# EAGLE design RQ2_supply (EAGLE 7.7.0)
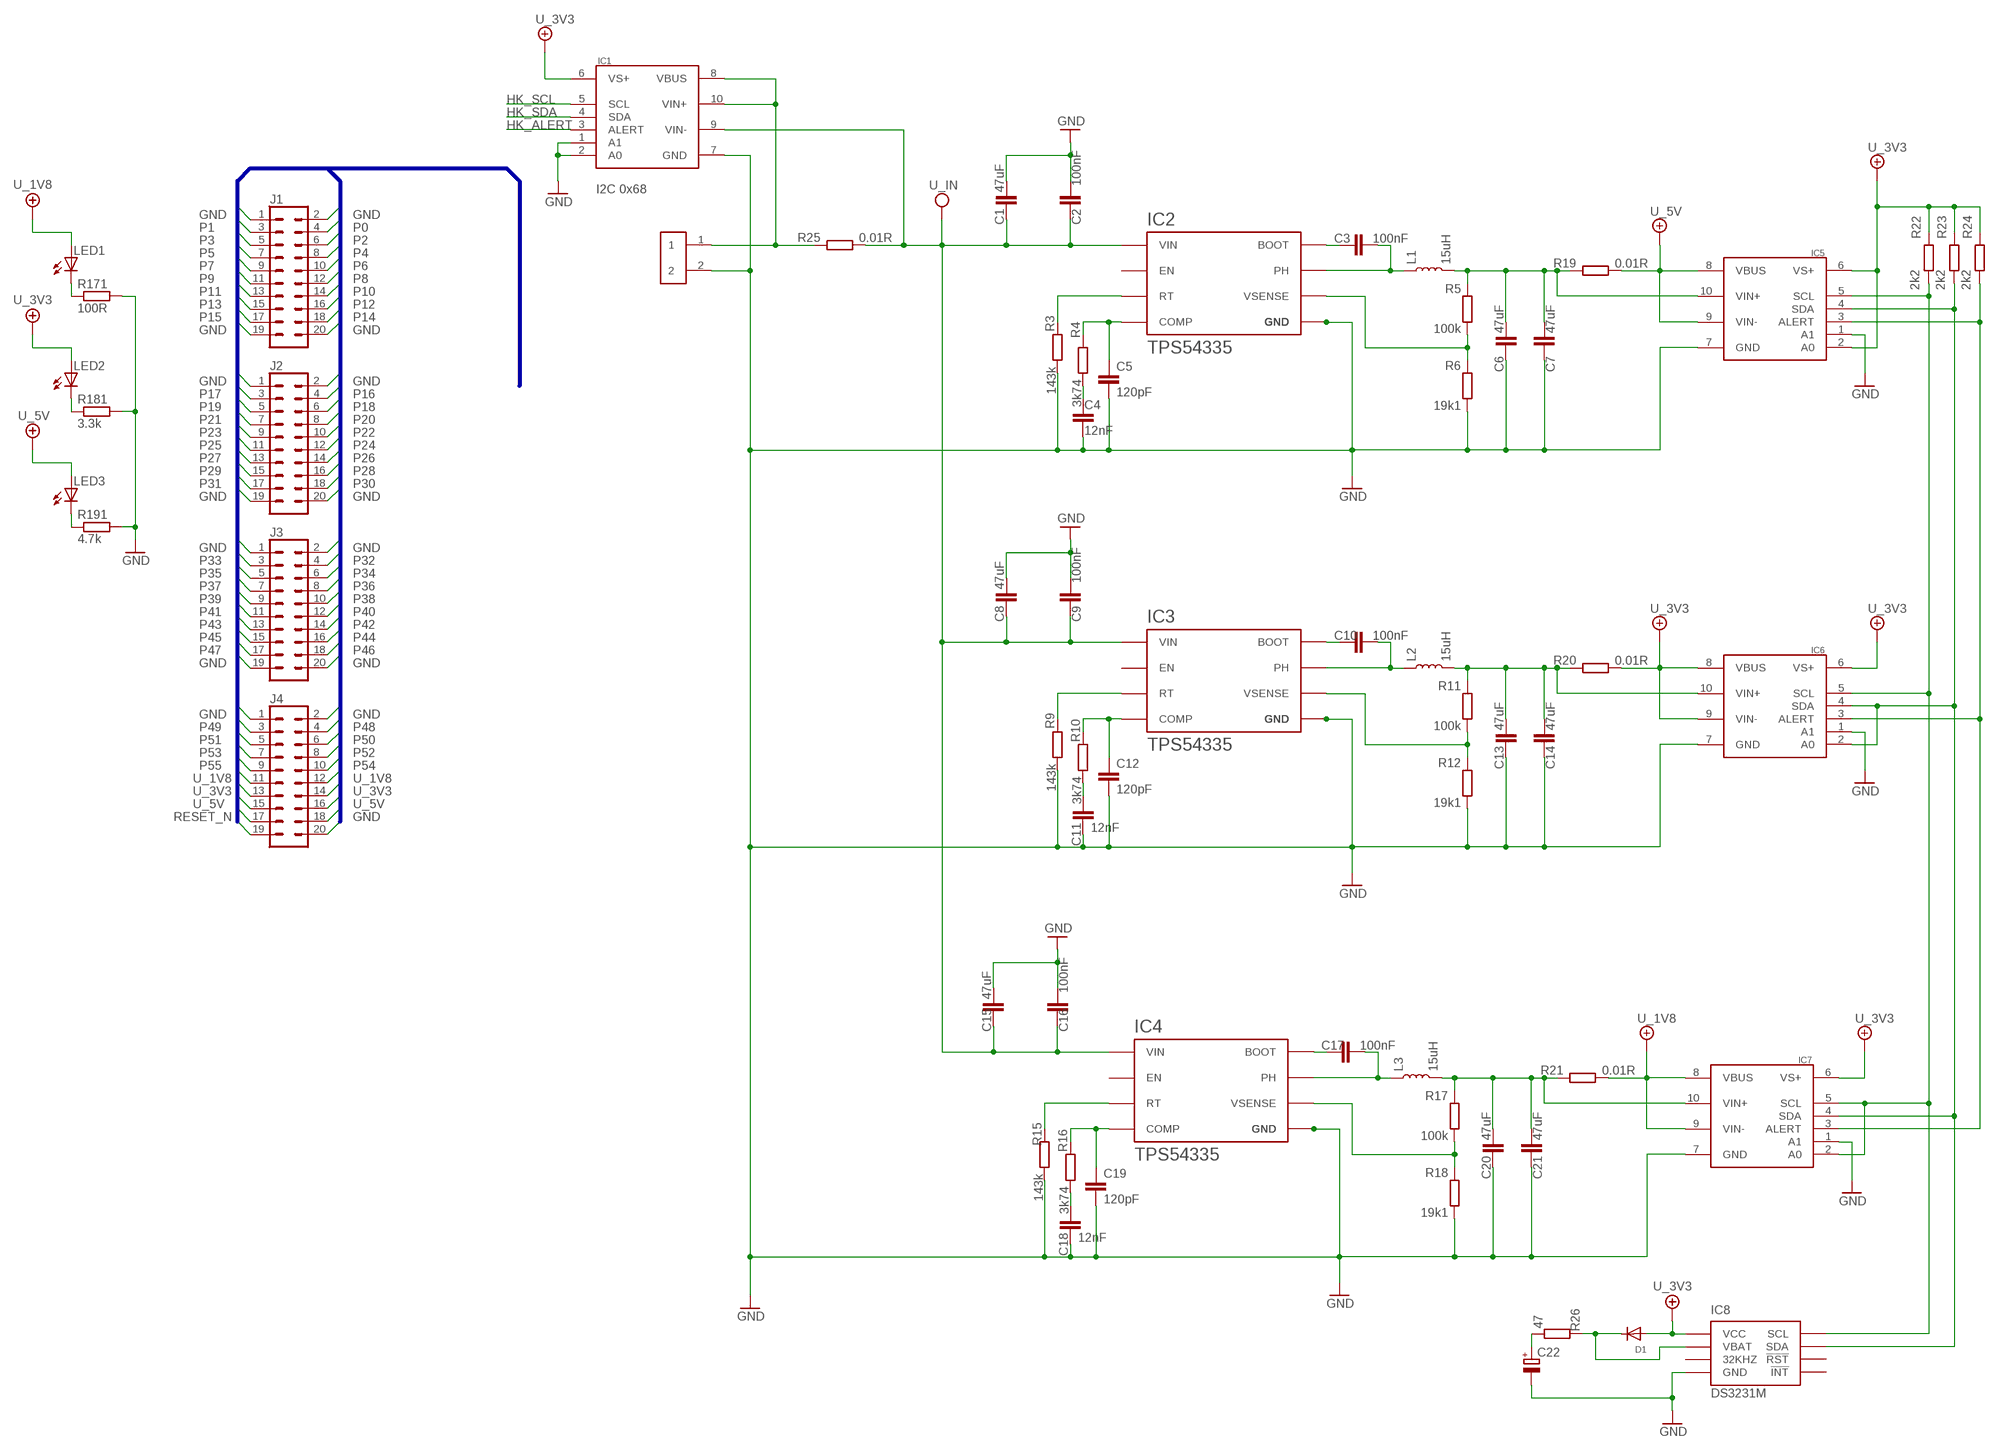
[diagram p0: schematic, sheet 1]

## Parts
C1  47uF  4.7UF-1206-16V-(+80/-20%)  [1206]
C2  100nF  0.1UF-0603-25V-5%  [0603]
C3  100nF  0.1UF-0402-16V-10%  [0402]
C4  12nF  C-EUC0402  [C0402]
C5  120pF  C-EUC0402  [C0402]
C6  47uF  47UF-1206-10V-20%  [1206]
C7  47uF  47UF-1206-10V-20%  [1206]
C8  47uF  4.7UF-1206-16V-(+80/-20%)  [1206]
C9  100nF  0.1UF-0603-25V-5%  [0603]
C10  100nF  0.1UF-0402-16V-10%  [0402]
C11  12nF  C-EUC0402  [C0402]
C12  120pF  C-EUC0402  [C0402]
C13  47uF  47UF-1206-10V-20%  [1206]
C14  47uF  47UF-1206-10V-20%  [1206]
C15  47uF  4.7UF-1206-16V-(+80/-20%)  [1206]
C16  100nF  0.1UF-0603-25V-5%  [0603]
C17  100nF  0.1UF-0402-16V-10%  [0402]
C18  12nF  C-EUC0402  [C0402]
C19  120pF  C-EUC0402  [C0402]
C20  47uF  47UF-1206-10V-20%  [1206]
C21  47uF  47UF-1206-10V-20%  [1206]
C22  CPOL-EUDHL_21.5  [DHL_21.5]
D1  DIODESOD-123  [SOD-123]
IC1  INA226  [VSSOP-10]
IC2  TPS54335ADRCR  [VSON-10]
IC3  TPS54335ADRCR  [VSON-10]
IC4  TPS54335ADRCR  [VSON-10]
IC5  INA226  [VSSOP-10]
IC6  INA226  [VSSOP-10]
IC7  INA226  [VSSOP-10]
IC8  DS3231M  [SO-8]
J1  CONN_10X2  [2X10]
J2  CONN_10X2  [2X10]
J3  CONN_10X2  [2X10]
J4  CONN_10X2  [2X10]
L1  15uH  INDUCTOR-YSPIA0850-15UH  [YSPIA0850]
L2  15uH  INDUCTOR-YSPIA0850-15UH  [YSPIA0850]
L3  15uH  INDUCTOR-YSPIA0850-15UH  [YSPIA0850]
LED1  LEDSML0805  [SML0805]
LED2  LEDSML0805  [SML0805]
LED3  LEDSML0805  [SML0805]
R3  143k  R-EU_R0402  [R0402]
R4  3k74  R-EU_R0402  [R0402]
R5  100k  R-EU_R0402  [R0402]
R6  19k1  R-EU_R0402  [R0402]
R9  143k  R-EU_R0402  [R0402]
R10  3k74  R-EU_R0402  [R0402]
R11  100k  R-EU_R0402  [R0402]
R12  19k1  R-EU_R0402  [R0402]
R15  143k  R-EU_R0402  [R0402]
R16  3k74  R-EU_R0402  [R0402]
R17  100k  R-EU_R0402  [R0402]
R18  19k1  R-EU_R0402  [R0402]
R19  0.01R  R-EU_R1206  [R1206]
R20  0.01R  R-EU_R1206  [R1206]
R21  0.01R  R-EU_R1206  [R1206]
R22  2k2  R-EU_R0402  [R0402]
R23  2k2  R-EU_R0402  [R0402]
R24  2k2  R-EU_R0402  [R0402]
R25  0.01R  R-EU_R1206  [R1206]
R26  47  R-EU_R0603  [R0603]
R171  100R  R-EU_R0805  [R0805]
R181  3.3k  R-EU_R0805  [R0805]
R191  4.7k  R-EU_R0805  [R0805]
U$1  XT_CONN  [XT30_PCB]

## Nets
DCDC_BOOT: C3.2 IC2.9(BOOT)
DCDC_BOOT1: C10.2 IC3.9(BOOT)
DCDC_BOOT2: C17.2 IC4.9(BOOT)
DCDC_COMP: C5.1 IC2.7(COMP) R4.1
DCDC_COMP1: C12.1 IC3.7(COMP) R10.1
DCDC_COMP2: C19.1 IC4.7(COMP) R16.1
DCDC_PH: C3.1 IC2.2(PH) L1.1
DCDC_PH1: C10.1 IC3.2(PH) L2.1
DCDC_PH2: C17.1 IC4.2(PH) L3.1
DCDC_RT: IC2.10(RT) R3.1
DCDC_RT1: IC3.10(RT) R9.1
DCDC_RT2: IC4.10(RT) R15.1
GND: C1.2 C2.1 C4.2 C5.2 C6.1 C7.1 C8.2 C9.1 C11.2 C12.2 C13.1 C14.1 C15.2 C16.1 C18.2 C19.2 C20.1 C21.1 C22.- IC1.1(A1) IC1.2(A0) IC1.7(GND) IC2.11(GND) IC3.11(GND) IC4.11(GND) IC5.1(A1) IC5.7(GND) IC6.1(A1) IC6.7(GND) IC7.1(A1) IC7.7(GND) IC8.5(GND) J1.1 J1.2 J1.19 J1.20 J2.1 J2.2 J2.19 J2.20 J3.1 J3.2 J3.19 J3.20 J4.1 J4.2 J4.18 R3.2 R6.1 R9.2 R12.1 R15.2 R18.1 R171.2 R181.2 R191.2 U$1.2
HK_ALERT: IC1.3(ALERT) IC5.3(ALERT) IC6.3(ALERT) IC7.3(ALERT) R24.1
HK_SCL: IC1.5(SCL) IC5.5(SCL) IC6.5(SCL) IC7.2(A0) IC7.5(SCL) IC8.8(SCL) R22.1
HK_SDA: IC1.4(SDA) IC5.4(SDA) IC6.2(A0) IC6.4(SDA) IC7.4(SDA) IC8.7(SDA) R23.1
N$1: C4.1 R4.2
N$2: LED1.C R171.1
N$3: LED2.C R181.1
N$4: LED3.C R191.1
N$5: C11.1 R10.2
N$7: C18.1 R16.2
P0: J1.4
P1: J1.3
P2: J1.6
P3: J1.5
P4: J1.8
P5: J1.7
P6: J1.10
P7: J1.9
P8: J1.12
P9: J1.11
P10: J1.14
P11: J1.13
P12: J1.16
P13: J1.15
P14: J1.18
P15: J1.17
P16: J2.4
P17: J2.3
P18: J2.6
P19: J2.5
P20: J2.8
P21: J2.7
P22: J2.10
P23: J2.9
P24: J2.12
P25: J2.11
P26: J2.14
P27: J2.13
P28: J2.16
P29: J2.15
P30: J2.18
P31: J2.17
P32: J3.4
P33: J3.3
P34: J3.6
P35: J3.5
P36: J3.8
P37: J3.7
P38: J3.10
P39: J3.9
P40: J3.12
P41: J3.11
P42: J3.14
P43: J3.13
P44: J3.16
P45: J3.15
P46: J3.18
P47: J3.17
P48: J4.4
P49: J4.3
P50: J4.6
P51: J4.5
P52: J4.8
P53: J4.7
P54: J4.10
P55: J4.9
RESET_N: J4.17
RXD: J4.20
TXD: J4.19
U0_1V8: C20.2 C21.2 IC7.10(VIN+) L3.2 R17.2 R21.2
U0_3V3: C13.2 C14.2 IC6.10(VIN+) L2.2 R11.2 R20.2
U0_5V: C6.2 C7.2 IC5.10(VIN+) L1.2 R5.2 R19.2
U0_IN: IC1.8(VBUS) IC1.10(VIN+) R25.2 U$1.1
U_1V8: IC7.8(VBUS) IC7.9(VIN-) J4.11 J4.12 LED1.A R21.1
U_3V3: D1.A IC5.2(A0) IC6.6(VS+) IC6.8(VBUS) IC6.9(VIN-) IC7.6(VS+) IC8.2(VCC) J4.13 J4.14 LED2.A R20.1 R22.2 R23.2 R24.2
U_5V: IC5.8(VBUS) IC5.9(VIN-) J4.15 J4.16 LED3.A R19.1
U_IN: C1.1 C2.2 C8.1 C9.2 C15.1 C16.2 IC1.9(VIN-) IC2.1(VIN) IC3.1(VIN) IC4.1(VIN) R25.1
VBAT1: D1.C IC8.6(VBAT) R26.1
VCAP: C22.+ R26.2
VSENSE_1V8: IC4.6(VSENSE) R17.1 R18.2
VSENSE_3V3: IC3.6(VSENSE) R11.1 R12.2
VSENSE_5V: IC2.6(VSENSE) R5.1 R6.2
Unconnected: IC1.6(VS+) IC2.8(EN) IC3.8(EN) IC4.8(EN) IC5.6(VS+) IC8.1(32KHZ) IC8.3(!INT) IC8.4(!RST)

## Buses
P[0..55],RXD,TXD,RESET_N,XIN,XOUT,U_1V8,U_3V3,U_5V,U_IN,GND

## Notes on the sheet
- I2C 0x68

## Power pins joined to a net without a drawn wire
GND: IC2.3(GND) IC2.4(GND) IC2.5(GND) IC3.3(GND) IC3.4(GND) IC3.5(GND) IC4.3(GND) IC4.4(GND) IC4.5(GND)

## Library data of the parts
C1 C8 C15 = SparkFun-Capacitors:4.7UF: 4.7µF ceramic capacitors A capacitor is a passive two-terminal electrical component used to store electrical energy temporarily in an electric field.; LCSC_PART: C132148; PROD_ID: CAP-10300; VALUE: 4.7uF
C2 C9 C16 = SparkFun-Capacitors:0.1UF: 100nF ceramic capacitors A capacitor is a passive two-terminal electrical component used to store electrical energy temporarily in an electric field.; LCSC_PART: C338036; PROD_ID: CAP-08604
C3 C10 C17 = SparkFun-Capacitors:0.1UF: 100nF ceramic capacitors A capacitor is a passive two-terminal electrical component used to store electrical energy temporarily in an electric field.; LCSC_PART: C338032; PROD_ID: CAP-12416
C4 C5 C11 C12 C18 C19 = rcl_updated:C-EU: CAPACITOR, European symbol
C6 C7 C13 C14 C20 C21 = SparkFun-Capacitors:47UF; LCSC_PART: C94034
C22 = rcl_updated:CPOL-EU: POLARIZED CAPACITOR, European symbol
D1 = adafruit:DIODE: Diode SMADIODE - SMA Surface Mount Package 20V 1A Schottky Diode Digikey: 641-1014-6-ND DO-1N4148 - Through Hole Small Current Diode SOD-123 20V 1 A (.5mV Vf) Schottky Diode - Digikey: MBRX120TPMSCT-ND SOD-323 10V 570mA (.38mV Vf, 3ns) Schottky Diode - Digikey: ZLLS410CT-ND SOD-523 30V 30mA Schottky Diode (RB751S-40TE61) - Digikey: RB751S-40TE61CT-ND SOT23-R/W - SOT23 Package (R = Solder Paste/Reflow Ovens, W = Hand-Soldering) BAT54Film 40V 300mA - Digikey: 497-7162-1-ND
IC1 IC5-IC7 = FaBo-Sensor:INA226; LCSC_PART: C49851
IC2-IC4 = texas_2:TPS54335ADRCR; LCSC_PART: C473400
IC8 = DS3231:DS3231M
J1-J4 = SparkFun-Connectors:CONN_10X2: Multi connection point. Often used as Generic Header-pin footprint for 0.1 inch spaced/style header connections On any of the 0.1 inch spaced packages, you can populate with these: Break Away Headers - Straight <https://www.sparkfun.com/products/116> (PRT-00116) Break Away Male Headers - Right Angle <https://www.sparkfun.com/products/553> (PRT-00553) Female Headers <https://www.sparkfun.com/products/115> (PRT-00115) Break Away Headers - Machine Pin <https://www.sparkfun.com/products/117> (PRT-00117) Break Away Female Headers - Swiss Machine Pin <https://www.sparkfun.com/products/743> (PRT-00743) Special note about the "SPECIAL" package: This was SPECIALLY designed to be used with our Graphic LCD Backpack. Be sure you want to use this! It is not only staggered on each line of header holes, but IT IS ALSO offset of the center point of the top and bottom lines by 5 mil. This causes the headers to lock into place on the "standard" footprint on the LCD screen. The extra squares on the tdocu layer are there simply to reference other pins (if you were to actually populate a longer header than ten long - this is what we do with the backpacks).
L1-L3 = SparkFun-Coils:INDUCTOR: Inductors Resist changes in electrical current. Basically a coil of wire. SparkFun Products: SparkFun Load Cell Amplifier - HX711 <https://www.sparkfun.com/products/13879> IOIO-OTG - V2.2 <https://www.sparkfun.com/products/13613>; LCSC_PART: C2839929
LED1-LED3 = led:LED: LED OSRAM: - CHIPLED LG R971, LG N971, LY N971, LG Q971, LY Q971, LO R971, LY R971 LH N974, LH R974 LS Q976, LO Q976, LY Q976 LO Q996 - Hyper CHIPLED LW Q18S LB Q993, LB Q99A, LB R99A - SideLED LS A670, LO A670, LY A670, LG A670, LP A670 LB A673, LV A673, LT A673, LW A673 LH A674 LY A675 LS A676, LA A676, LO A676, LY A676, LW A676 LS A679, LY A679, LG A679 - Hyper Micro SIDELED® LS Y876, LA Y876, LO Y876, LY Y876 LT Y87S - SmartLED LW L88C, LW L88S LB L89C, LB L89S, LG L890 LS L89K, LO L89K, LY L89K LS L896, LA L896, LO L896, LY L896 - TOPLED LS T670, LO T670, LY T670, LG T670, LP T670 LSG T670, LSP T670, LSY T670, LOP T670, LYG T670 LG T671, LOG T671, LSG T671 LB T673, LV T673, LT T673, LW T673 LH T674 LS T676, LA T676, LO T676, LY T676, LB T676, LH T676, LSB T676, LW T676 LB T67C, LV T67C, LT T67C, LS T67K, LO T67K, LY T67K, LW E67C LS E67B, LA E67B, LO E67B, LY E67B, LB E67C, LV E67C, LT E67C LW T67C LS T679, LY T679, LG T679 LS T770, LO T770, LY T770, LG T770, LP T770 LB T773, LV T773, LT T773, LW T773 LH T774 LS E675, LA E675, LY E675, LS T675 LS T776, LA T776, LO T776, LY T776, LB T776 LHGB T686 LT T68C, LB T68C - Hyper Mini TOPLED® LB M676 - Mini TOPLED Santana® LG M470 LS M47K, LO M47K, LY M47K Source: http://www.osram.convergy.de LUXEON: - LUMILED® LXK2-PW12-R00, LXK2-PW12-S00, LXK2-PW14-U00, LXK2-PW14-V00 LXK2-PM12-R00, LXK2-PM12-S00, LXK2-PM14-U00 LXK2-PE12-Q00, LXK2-PE12-R00, LXK2-PE12-S00, LXK2-PE14-T00, LXK2-PE14-U00 LXK2-PB12-K00, LXK2-PB12-L00, LXK2-PB12-M00, LXK2-PB14-N00, LXK2-PB14-P00, LXK2-PB14-Q00 LXK2-PR12-L00, LXK2-PR12-M00, LXK2-PR14-Q00, LXK2-PR14-R00 LXK2-PD12-Q00, LXK2-PD12-R00, LXK2-PD12-S00 LXK2-PH12-R00, LXK2-PH12-S00 LXK2-PL12-P00, LXK2-PL12-Q00, LXK2-PL12-R00 Source: www.luxeon.com KINGBRIGHT: KA-3528ASYC Source: www.kingbright.com
R3-R6 R9-R12 R15-R25 = rcl_updated:R-EU_: RESISTOR, European symbol
R26 R171 R181 R191 = rcl:R-EU_: RESISTOR, European symbol
U$1 = SparkFun-Connectors:XT_CONN

## Board
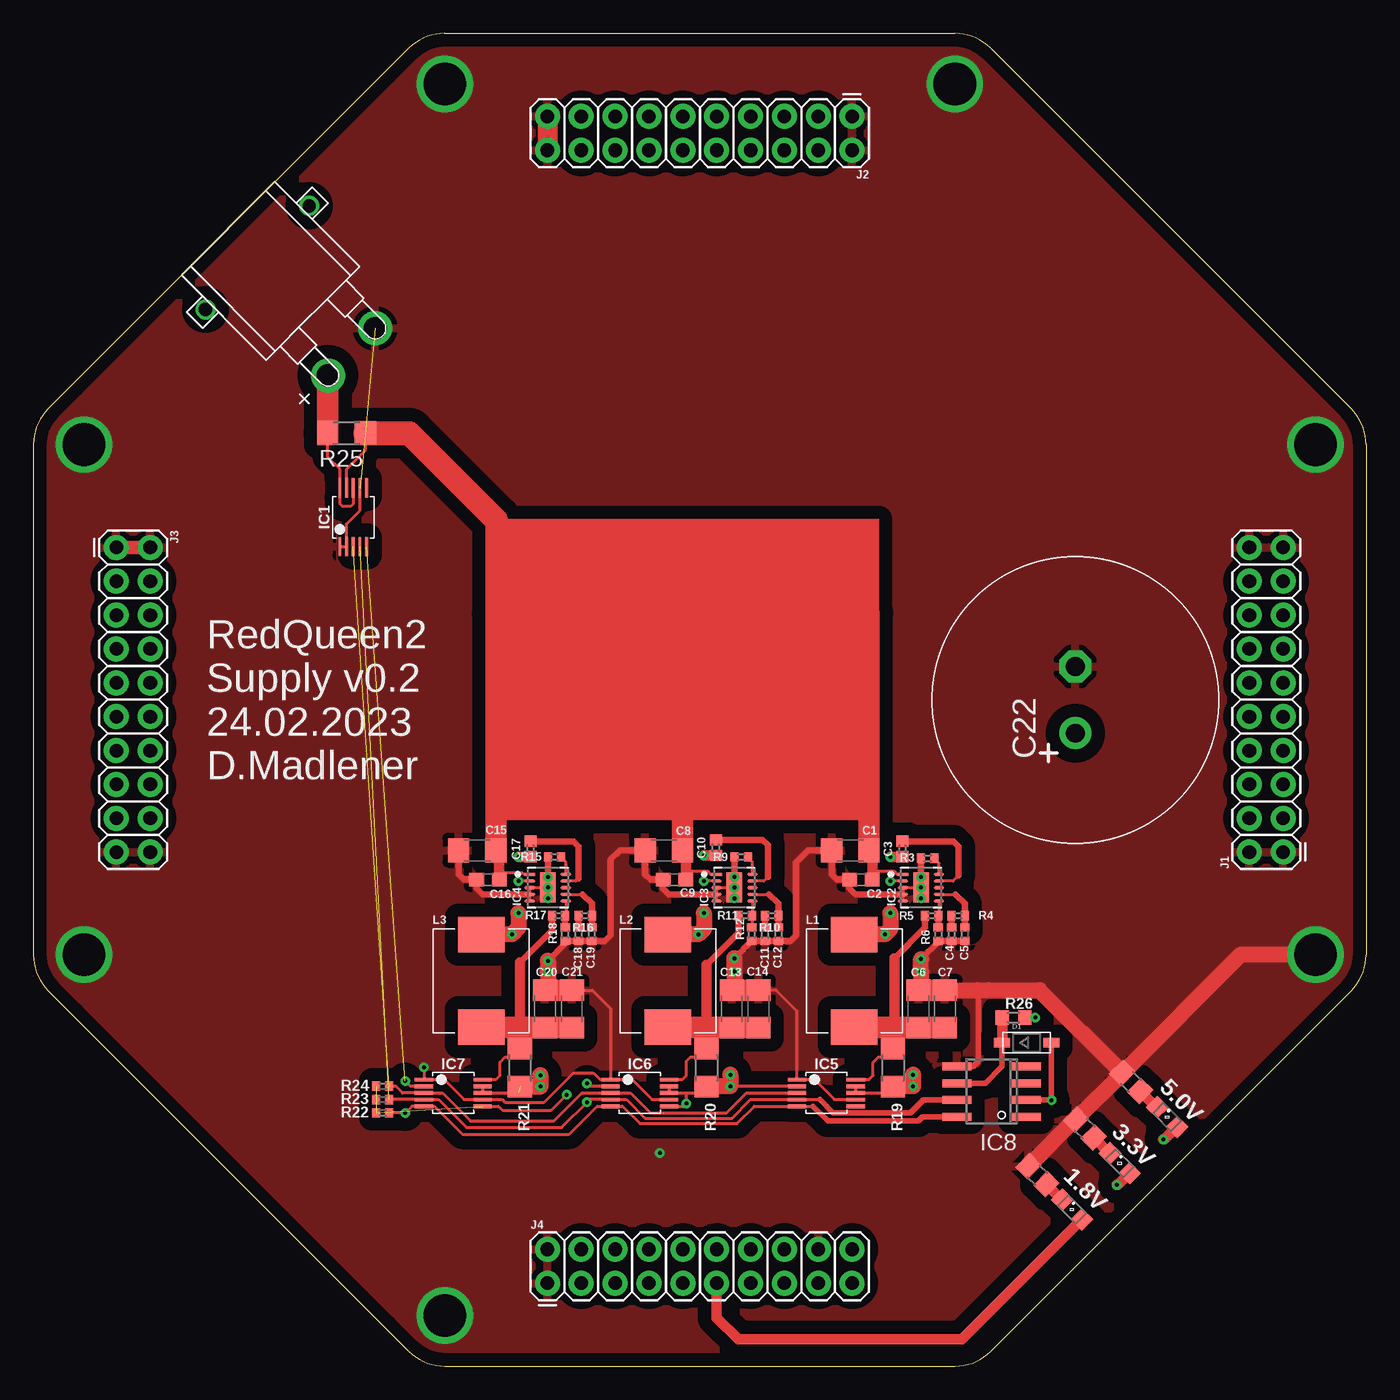
[diagram p1: board, top side]
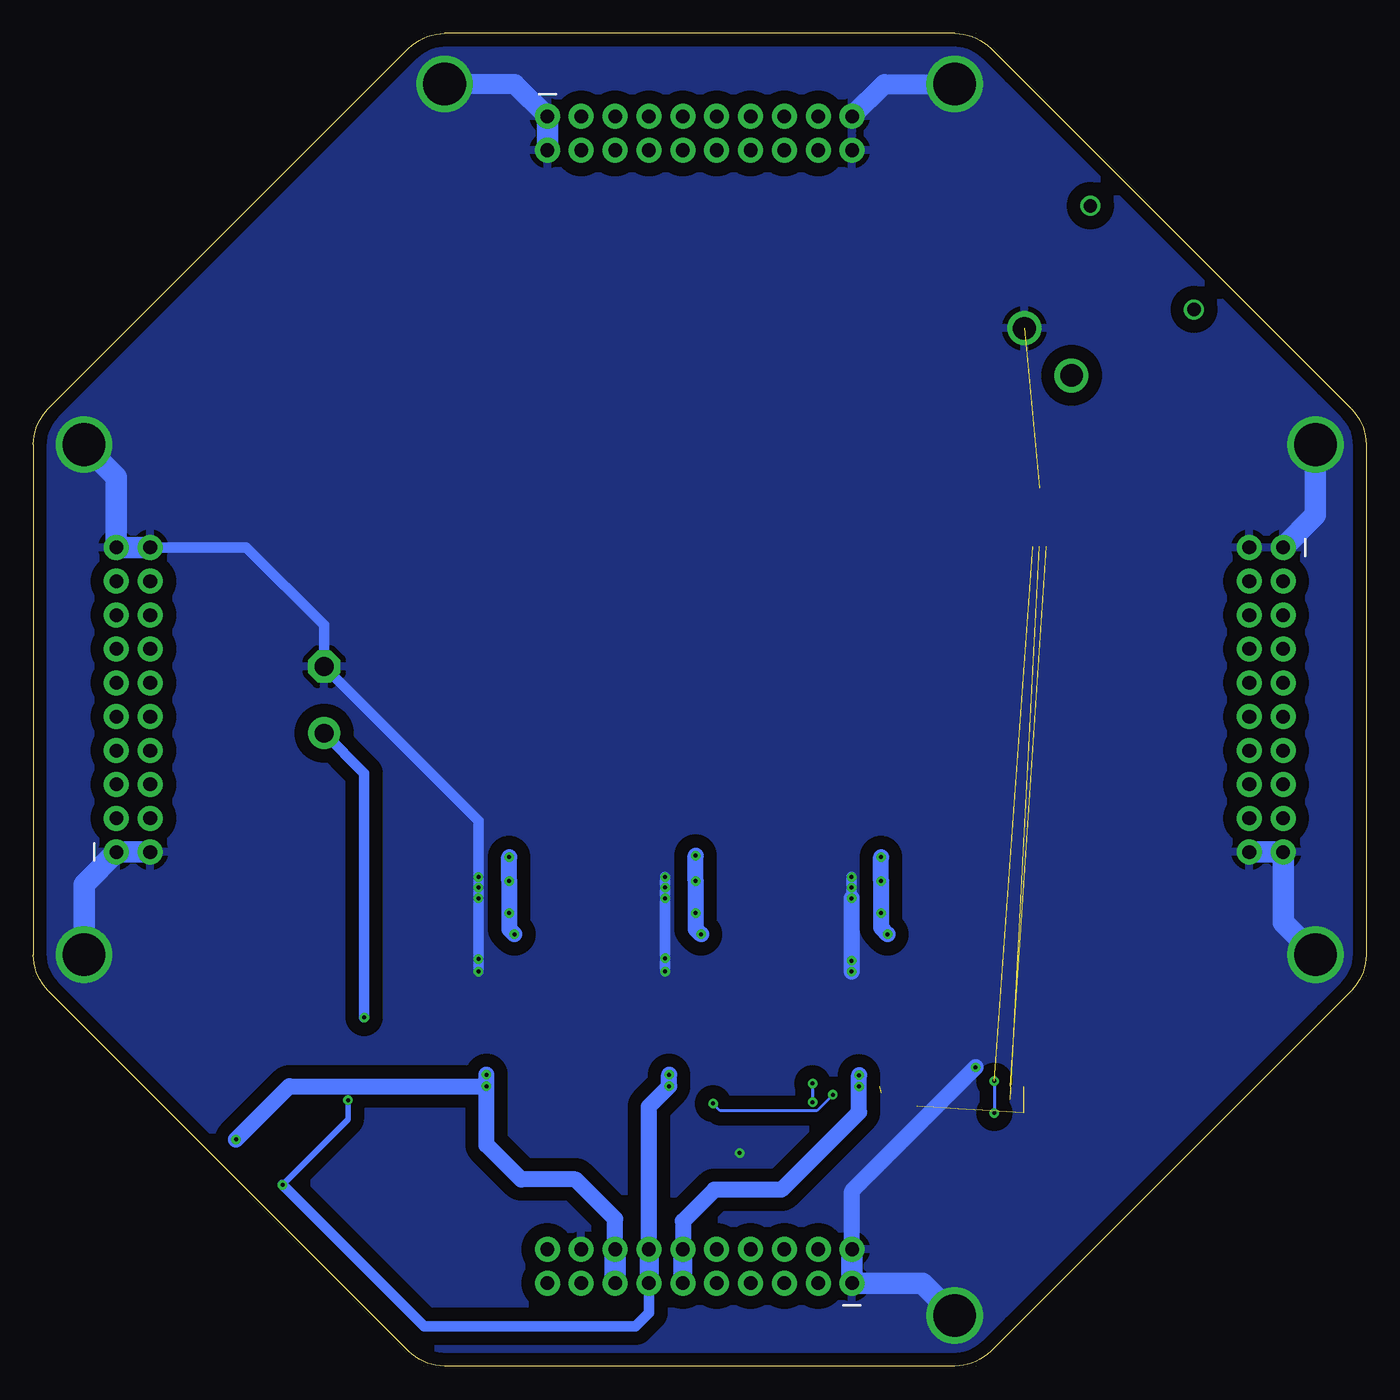
[diagram p2: board, bottom side, seen from below]

Size 100 x 100 mm. Coordinates in mm from the lower left corner, seen from the top.
Outline: 100,70.71 100,70.71
Outline: 100,29.29 100,29.29
Outline: 29.29,100 29.29,100
Outline: 70.71,100 70.71,100
Outline: 100,29.29 100,29.29
Outline: 70.71,0 70.71,0
Outline: 70.71,100 70.71,100
Outline: 100,70.71 100,70.71
Outline: 0,70.71 0,70.71
Outline: 26.36,97.07 26.36,97.07
Outline: 2.93,73.64 2.93,73.64
Outline: 29.29,100 29.29,100
Outline: 29.29,0 29.29,0
Outline: 2.93,26.36 2.93,26.36
Outline: 0,29.29 0,29.29
Outline: 0,70.71 0,70.71
Outline: 26.36,2.93 26.36,2.93
Outline: 0,29.29 0,29.29
Outline: 70.71,0 70.71,0
Outline: 29.29,0 29.29,0
Outline: 1.12,71.83 arc45 0,69.14 0,30.87 arc45 1.12,28.17 28.18,1.12 arc45 30.87,0 69.14,0 arc45 71.83,1.12 98.89,28.17 arc45 100,30.87 100,69.13 arc45 98.89,71.83 71.83,98.89 arc45 69.13,100 30.87,100 arc45 28.18,98.89 1.12,71.83
Copper layers (1*16): Top 0.035mm / dielectric 1.5mm / Bottom 0.035mm
Design rules "default *": minimum track width 10mil, minimum drill 0.3mm, track to track 6mil, track to pad 6mil, pad to pad 6mil, via to via 6mil, smd to smd 6mil, copper to edge 20mil, drill to drill 8mil, minimum pad ring 10mil, minimum via ring 8mil, stop-mask expansion 4mil, vias tented up to drill 0mil, thermal gap 16mil

### Footprints (pad centres in the part's own frame; a part is rotated, then mirrored left to right if it is on the bottom)
1206 = smd 1.6 x 1.8: 1 -1.4,0; 2 1.4,0
0603 = smd 1.1 x 1: 1 -0.85,0; 2 0.85,0
0402 = smd 0.85 x 0.9: 1 -0.58,0; 2 0.58,0
C0402 = smd 0.6 x 0.7: 1 -0.5,0; 2 0.5,0
DHL_21.5 = drill 1.4 pad 2.4: + -2.5,0 | drill 1.4 pad 2.4 octagon: - 2.5,0
SOD-123 = smd 1.2 x 0.7: A 1.85,0; C -1.85,0
VSSOP-10 = smd 1.45 x 0.3: 1 -2.2,1; 2 -2.2,0.5; 3 -2.2,0; 4 -2.2,-0.5; 5 -2.2,-1; 6 2.2,-1; 7 2.2,-0.5; 8 2.2,0; 9 2.2,0.5; 10 2.2,1
VSON-10 = smd 0.81 x 0.239: 1 -1.351,1; 2 -1.351,0.5; 3 -1.351,0; 4 -1.351,-0.5; 5 -1.351,-1; 6 1.351,-1; 7 1.351,-0.5; 8 1.351,0; 9 1.351,0.5; 10 1.351,1 | smd 1.16 x 2.25: 11 0,0
SO-8 = smd 0.6 x 2.2: 1 -1.905,-2.6; 2 -0.635,-2.6; 3 0.635,-2.6; 4 1.905,-2.6; 5 1.905,2.6; 6 0.635,2.6; 7 -0.635,2.6; 8 -1.905,2.6
2X10 = drill 1.016 pad 1.88: 1 0,0; 2 0,2.54; 3 2.54,0; 4 2.54,2.54; 5 5.08,0; 6 5.08,2.54; 7 7.62,0; 8 7.62,2.54; 9 10.16,0; 10 10.16,2.54; 11 12.7,0; 12 12.7,2.54; 13 15.24,0; 14 15.24,2.54; 15 17.78,0; 16 17.78,2.54; 17 20.32,0; 18 20.32,2.54; 19 22.86,0; 20 22.86,2.54
YSPIA0850 = smd 2.65 x 3.5: 1 -3.475,0; 2 3.475,0
SML0805 = smd 1.2 x 1.2: A 1.05,0; C -1.05,0
R0402 = smd 0.6 x 0.7: 1 -0.5,0; 2 0.5,0
R1206 = smd 1.6 x 1.803: 1 -1.422,0; 2 1.422,0
R0603 = smd 1 x 1.1: 1 -0.85,0; 2 0.85,0
R0805 = smd 1.3 x 1.5: 1 -0.95,0; 2 0.95,0
XT30_PCB = drill 1.7: 1 -2.5,0; 2 2.5,0 | drill 1: AUX1 -5.5,10; AUX2 5.5,10

### Placement (x,y rotation side)
C1  61.3,38.7 180 top
C2  62.1,36.5 0 top
C3  65.2,38.8 90 top
C4  68.9,32.4 270 top
C5  69.9,32.4 270 top
C6  66.4,26.8 270 top
C7  68.4,26.8 270 top
C8  47.3,38.7 180 top
C9  48.1,36.5 0 top
C10  51.2,38.9 90 top
C11  54.9,32.4 270 top
C12  55.9,32.4 270 top
C13  52.4,26.8 270 top
C14  54.4,26.8 270 top
C15  33.3,38.7 180 top
C16  34.1,36.5 0 top
C17  37.3,38.8 90 top
C18  40.9,32.4 270 top
C19  41.9,32.4 270 top
C20  38.4,26.8 270 top
C21  40.4,26.8 270 top
C22  78.18,49.99 90 top
D1  74.52,24.27 0 top
IC1  24,63.7 90 top
IC2  66.6,35.9 0 top
IC3  52.6,35.9 0 top
IC4  38.6,35.9 0 top
IC5  59.5,20.5 0 top
IC6  45.5,20.5 0 top
IC7  31.5,20.5 0 top
IC8  71.9,20.6 90 top
J1  93.77,38.57 90 top
J2  61.43,93.77 180 top
J3  6.23,61.43 270 top
J4  38.57,6.23 0 top
L1  61.6,28.9 270 top
L2  47.6,28.9 270 top
L3  33.6,28.9 270 top
LED1  77.94,11.74 315 top
LED2  81.51,15.23 315 top
LED3  85.07,18.69 315 top
R3  67.1,38.1 180 top
R4  69.4,33.8 180 top
R5  67.4,33.8 180 top
R6  67.9,32.4 90 top
R9  53.1,38.2 180 top
R10  55.4,33.8 180 top
R11  53.4,33.8 180 top
R12  53.9,32.4 90 top
R15  39.1,38.2 180 top
R16  41.4,33.8 180 top
R17  39.4,33.8 180 top
R18  39.9,32.4 90 top
R19  64.5,22.4 90 top
R20  50.5,22.4 90 top
R21  36.5,22.4 90 top
R22  26.2,19 180 top
R23  26.2,20 180 top
R24  26.2,21 180 top
R25  23.5,70 180 top
R26  73.54,26.15 0 top
R171  75.33,14.33 135 top
R181  78.89,17.83 135 top
R191  82.36,21.32 135 top
U$1  23.88,76.1 45 top

### Tracks (layer width: path | path; a pad name or v marks a point on that pad's centre or on a via)
DCDC_BOOT
  Top 0.24: 69.4,36.8 69,36.4 IC2.9
  Top 0.5: C3.2 69.02,39.38 69.4,39 69.4,36.8
DCDC_BOOT1
  Top 0.24: 55.1,36.7 54.8,36.4 IC3.9
  Top 0.5: C10.2 54.72,39.48 55.1,39.1 55.1,36.7
DCDC_BOOT2
  Top 0.24: 40.9,36.6 40.7,36.4 IC4.9
  Top 0.5: C17.2 40.52,39.38 40.9,39 40.9,36.6
DCDC_COMP
  Top 0.24: IC2.7 69.2,35.4
  Top 0.5: C5.1 R4.1 69.9,34.7 69.2,35.4
DCDC_COMP1
  Top 0.24: IC3.7 55.2,35.4
  Top 0.5: C12.1 R10.1 55.9,34.7 55.2,35.4
DCDC_COMP2
  Top 0.24: IC4.7 41.2,35.4
  Top 0.5: C19.1 R16.1 41.9,34.7 41.2,35.4
DCDC_PH  (via drill 0.3)
  Top 0.24: IC2.2 v64.3,36.4
  Top 0.8: 61.63,32.4 L1.1 | 65.18,38.2 C3.1 65.2,38.2 v64.3,38.2
  Top 1.2: 61.63,32.4 v63.9,32.4 64.3,32.8 v64.3,34
  Bottom 1.2: v64.3,38.2 v64.3,36.4 64.3,32.8 v63.9,32.4
DCDC_PH1  (via drill 0.3)
  Top 0.24: IC3.2 v50.3,36.4
  Top 0.8: 51.18,38.3 C10.1 51.2,38.3 v50.3,38.3 | 47.63,32.4 L2.1
  Top 1.2: 47.63,32.4 v49.9,32.4 50.3,32.8 v50.3,34
  Bottom 1.2: v50.3,38.3 v50.3,36.4 50.3,32.8 v49.9,32.4
DCDC_PH2  (via drill 0.3)
  Top 0.24: IC4.2 v36.4,36.4
  Top 0.8: 37.28,38.2 C17.1 37.3,38.2 v36.4,38.2 | 33.63,32.4 L3.1
  Top 1.2: 33.63,32.4 v35.9,32.4 36.4,32.9 v36.4,34
  Bottom 1.2: v36.4,38.2 v36.4,36.4 36.4,32.9 v35.9,32.4
DCDC_RT
  Top 0.24: IC2.10 67.95,37.75 R3.1
DCDC_RT1
  Top 0.24: IC3.10 53.95,37.85 R9.1
DCDC_RT2
  Top 0.24: IC4.10 39.95,37.85 R15.1
GND  (via drill 0.3, 3.2)  (1 unrouted)
  Top 0.24: IC4.5 IC4.4 IC4.3 IC4.11 v38.6,36.7 | IC3.5 IC3.4 IC3.3 IC3.11 v52.6,36.7 | IC2.5 IC2.4 IC2.3 IC2.11 v66.6,36.7 | IC6.1 44.9,21.5 46.4,20 IC6.7 | IC5.7 60.1,20 58.6,21.5 IC5.1 57.3,26.62 55.72,28.2 C14.1 | IC1.1 IC1.2 23.5,63.2 24.5,64.2 IC1.7 | IC6.1 42.53,21.5 42.03,22 40.53,22 38.33,19.8 35.4,19.8 35.2,20 IC7.7 32.3,20 30.8,21.5 IC7.1 v29.3,22.42 | C21.1 41.94,28.2 43.3,26.84 IC6.1
  Top 0.4: 71.67,28.19 71.66,28.2 | IC8.5 70.55,22.51 70.91,22.87 70.91,28.15 70.86,28.2
  Top 0.5: C5.2 C4.2 R6.1 67.9,31.84 v66.6,30.54 | IC2.4 61.7,35.4 61.25,35.85 C2.1 60.3,36.5 59.9,36.9 C1.2 58.1,38.7 57.2,37.8 57.2,32.3 56.8,31.9 C12.2 C11.2 R12.1 v52.6,30.61 | IC3.4 47.7,35.4 47.25,35.85 C9.1 46.3,36.5 45.9,36.9 C8.2 44,38.7 43.3,38 43.3,32.3 42.9,31.9 C19.2 C18.2 R18.1 39.9,31.72 v38.6,30.42 | IC4.4 33.7,35.4 33.25,35.85 C16.1 32.3,36.5 31.9,36.9 C15.2 | R3.2 v66.6,36.7 | R9.2 v52.6,36.7 | R15.2 v38.6,36.7
  Top 0.8: 52.6,28.4 C13.1 | 66.6,28.4 C6.1 | 38.6,28.4 C20.1 | 78.16,18.5 R181.2 | 81.69,21.98 R191.2
  Top 1: J3.1 J3.2
  Top 1.2: 52.6,28.4 v52.6,29.6 v52.6,30.61 | 66.6,28.4 v66.6,29.6 v66.6,30.54 | 38.6,28.4 v38.6,29.6 v38.6,30.42 | R171.2 78.16,18.5 | R181.2 81.69,21.98 90.6,30.88 v96.2,30.88 | C7.1 70.86,28.2 71.66,28.2 75.49,28.2 R191.2
  Top 1.5: J2.19 J2.20
  Top 1.6: C13.1 C14.1 | C6.1 C7.1 | C20.1 C21.1
  Bottom 0.8: v52.6,29.6 v52.6,35.1 IC3.11 v52.6,36.7 | v66.6,29.6 v66.6,35.1 IC2.11 v66.6,36.7 66.6,40.91 C22.- 78.18,55.59 84.02,61.43 J1.20 | v38.6,35.1 IC4.11 v38.6,36.7
  Bottom 1.2: J4.2 38.57,13.15 v29.3,22.42 | v38.6,35.1 v38.6,29.6
  Bottom 1.5: J2.1 63.86,96.2 v69.14,96.2 | J2.19 36.14,96.2 v30.88,96.2
  Bottom 1.6: J4.2 J4.1 33.31,6.23 v30.88,3.8 | J2.1 J2.2 | J1.20 J1.19 93.77,66.71 v96.2,69.14 | J1.2 J1.1 96.2,36.14 v96.2,30.88 | J3.20 J3.19 6.23,33.31 v3.8,30.88 | v3.8,69.14 3.8,63.86 J3.1
  other vias: 66.6,35.9 52.6,35.9 38.6,35.9 47,16
  pour Top (isolate 1): 70.7,100.01 100,70.71 100,29.29 70.72,0 29.3,0 0,29.29 0,70.71 29.29,100
  pour Bottom (isolate 1): 70.7,100.01 100,70.71 100,29.29 70.72,0 29.3,0 0,29.29 0,70.71 29.29,100
HK_ALERT  (1 unrouted)
  Top 0.24: R24.1 27.2,21 27.7,20.5 IC7.3 30.7,20.5 32.8,18.4 39.07,18.41 41.17,20.51 IC6.3 44.8,20.5 46.3,19 52,19 53.5,20.5 IC5.3
HK_SCL  (via drill 0.3)  (1 unrouted)
  Top 0.24: R22.1 v27.9,19 28.4,19.5 IC7.5 30.1,19.5 32.2,17.4 40.2,17.4 42.3,19.5 IC6.5 44.2,19.5 45.5,18.2 52.8,18.2 54.1,19.5 IC5.5 58.5,19.5 | IC7.2 28.3,21 v27.9,21.4
  Top 0.4: 58.5,19.5 59.6,18.4 66.4,18.4 66.7,18.7 IC8.8
  Bottom 0.24: v27.9,21.4 v27.9,19
HK_SDA  (via drill 0.3)  (1 unrouted)
  Top 0.24: R23.1 IC7.4 30.4,20 32.5,17.9 39.64,17.9 v41.54,19.8 41.74,20 IC6.4 44.5,20 45.9,18.6 52.4,18.6 53.8,20 IC5.4 59,20 | IC6.2 41.74,21 v41.54,21.2
  Top 0.4: 59,20 60,19 65.8,19 66.77,19.97 IC8.7
  Bottom 0.24: v41.54,21.2 v41.54,19.8
N$1
  Top 0.5: R4.2 C4.1
N$2
  Top 0.8: R171.1 77.18,12.49 LED1.C
N$3
  Top 0.8: R181.1 80.75,15.97 LED2.C
N$4
  Top 0.8: R191.1 84.25,19.43 LED3.C
N$5
  Top 0.5: R10.2 C11.1
N$7
  Top 0.5: R16.2 C18.1
U0_1V8
  Top 0.24: IC7.10 34.7,21.5 35,21.8 35,22.8 35.4,23.2 35.7,23.2 36.32,23.82 R21.2
  Top 0.5: R17.2 38.9,32.7 36.5,30.3
  Top 0.8: 36.5,30.3 36.5,25.4
  Top 1.6: L3.2 33.6,25.4 36.5,25.4 | 36.5,25.4 C20.2 C21.2 | R21.2 36.5,25.4
U0_3V3
  Top 0.24: IC6.10 48.7,21.5 49,21.8 49,22.9 49.3,23.2 50.1,23.2 50.5,23.6 R20.2
  Top 0.5: R11.2 52.9,32.5 50.5,30.1 | 50.5,25.5 50.4,25.4
  Top 0.8: 50.5,30.1 50.5,25.5
  Top 1.6: L2.2 47.6,25.4 50.4,25.4 50.5,25.4 | 50.5,25.4 C13.2 C14.2 | R20.2 50.5,25.4
U0_5V
  Top 0.24: IC5.10 62.7,21.5 63,21.8 63,22.8 63.4,23.2 64.1,23.2 64.5,23.6 R19.2
  Top 0.5: R5.2 66.9,32.9 64.6,30.6
  Top 0.8: 64.6,30.6 64.6,25.4
  Top 1.6: L1.2 61.6,25.4 64.5,25.4 | 64.5,25.4 64.6,25.4 C6.2 C7.2 | R19.2 64.5,25.4
U0_IN
  Top 0.24: R25.2 22.08,68.22 23,67.3 IC1.10 23,64.7 23.2,64.5 23.8,64.5 24,64.7 IC1.8
  Top 1: U$1.1 22.08,74.33
  Top 1.6: 22.08,74.33 R25.2
U_1V8  (via drill 0.3)  (1 unrouted)
  Top 0.24: IC7.9 IC7.8 36.42,20.5
  Top 0.8: LED1.A 69.68,2 52.9,2 51.27,3.63 J4.11 | v38.05,20.98
  Top 1.2: R21.1 v38.05,20.98 | v38.05,21.83 v38.05,20.98
  Bottom 1.2: J4.12 51.27,10.88 48.91,13.24 43.87,13.24 38.05,19.06 v38.05,21.83
  Bottom 1.422: J4.11 J4.12
U_3V3  (via drill 0.3)  (3 unrouted)
  Top 0.24: IC6.9 IC6.8 48.9,20.5 | 48.9,20.5 50.42,20.5 R20.1 | IC6.6 48.8,19.5 v49,19.7 49,20.4 48.9,20.5 | IC5.2 v52.3,21 | IC7.6 34.9,19.5 35.2,19.2 38.86,19.2 v40.02,20.36
  Top 0.4: IC8.2 v76.39,19.97 | v76.39,19.97 v76.39,19.96 | v76.39,19.97 76.39,24.27 D1.A
  Top 0.8: LED2.A 81.37,13.6 v81.3,13.6
  Top 1.2: R20.1 50.52,21 v52.3,21 v52.3,21.87
  Bottom 0.24: v40.02,20.36 41.21,19.17 48.47,19.17 v49,19.7
  Bottom 0.4: v76.39,19.96 76.39,18.51 v81.3,13.6
  Bottom 0.8: v81.3,13.6 70.7,3 54.8,3 53.81,3.99 J4.13
  Bottom 1.2: J4.14 53.81,19.49 v52.3,21 v52.3,21.87
  Bottom 1.422: J4.14 J4.13
U_5V  (via drill 0.3)
  Top 0.24: IC5.9 IC5.8 64.5,20.5 R19.1
  Top 0.8: LED3.A 84.87,17 v84.8,17 | 64.52,21 R19.1
  Top 1.2: 64.52,21 v66,21 v66,21.86
  Bottom 1.2: v84.8,17 80.8,21 v66,21 | J4.16 56.35,11.05 59.3,14 63.4,14 66,16.6 v66,21.86
  Bottom 1.6: J4.15 J4.16
U_IN
  Top 0.24: IC1.9 23.5,67.3 24.92,68.72 R25.1 | IC4.1 36.8,36.9 36.7,37 35.05,37 34.95,37.1 | IC3.1 50.8,36.9 50.6,37.1 49.05,37.1 48.95,37 | IC2.1 64.8,36.9 64.6,37.1 63.05,37.1 62.95,37.2
  Top 0.8: C16.2 34.95,37.1 34.95,38.7 C15.1 | C9.2 48.95,37 48.95,38.7 C8.1 | C2.2 62.95,37.2 62.95,38.7 C1.1
  Top 1.6: 34.7,63.5 34.7,56.5 | 34.7,56.5 C15.1 | C8.1 48.7,56.5 | 48.7,56.5 34.7,56.5 | C1.1 62.7,56.5 48.7,56.5
  Top 1.8: R25.1 28.2,70 34.7,63.5
VBAT1
  Top 0.4: IC8.6 71.42,21.24 72.67,22.49 D1.C 72.69,24.29
  Top 0.8: R26.1 72.69,24.29
VCAP  (via drill 0.3)
  Top 0.4: R26.2 v75.17,26.15
  Bottom 0.8: v75.17,26.15 75.17,44.48 C22.+
VSENSE_1V8
  Top 0.24: IC4.6 39.95,33.8 R17.1
  Top 0.5: R17.1 R18.2
VSENSE_3V3
  Top 0.24: IC3.6 53.95,33.8 R11.1 R12.2
VSENSE_5V
  Top 0.24: IC2.6 67.95,33.8 R5.1
  Top 0.5: R5.1 R6.2
(copper drawn outside any net)
  shapes: Top area x1

### Text on the board
tPlace: RedQueen2 / Supply v0.2 / 24.02.2023 / D.Madlener | 5.0V | 3.3V | 1.8V